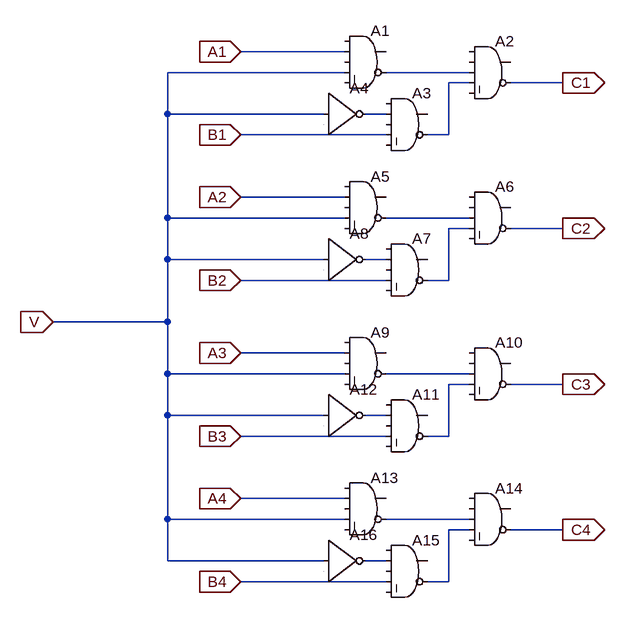
[diagram p0: schematic mul.asc]
mul.asc, the LTspice schematic file:
Version 4
SHEET 1 2100 968
WIRE 592 -176 432 -176
WIRE 592 -144 320 -144
WIRE 784 -144 656 -144
WIRE 784 -128 752 -128
WIRE 928 -128 848 -128
WIRE 320 -80 320 -144
WIRE 560 -80 320 -80
WIRE 656 -80 624 -80
WIRE 656 -48 432 -48
WIRE 752 -48 752 -128
WIRE 752 -48 720 -48
WIRE 592 48 432 48
WIRE 320 80 320 -80
WIRE 592 80 320 80
WIRE 784 80 656 80
WIRE 784 96 752 96
WIRE 928 96 848 96
WIRE 320 144 320 80
WIRE 560 144 320 144
WIRE 656 144 624 144
WIRE 656 176 432 176
WIRE 752 176 752 96
WIRE 752 176 720 176
WIRE 320 240 320 144
WIRE 320 240 144 240
WIRE 592 288 432 288
WIRE 320 320 320 240
WIRE 592 320 320 320
WIRE 784 320 656 320
WIRE 784 336 752 336
WIRE 928 336 848 336
WIRE 320 384 320 320
WIRE 560 384 320 384
WIRE 656 384 624 384
WIRE 656 416 432 416
WIRE 752 416 752 336
WIRE 752 416 720 416
WIRE 592 512 432 512
WIRE 320 544 320 384
WIRE 592 544 320 544
WIRE 784 544 656 544
WIRE 784 560 752 560
WIRE 928 560 848 560
WIRE 320 608 320 544
WIRE 560 608 320 608
WIRE 656 608 624 608
WIRE 656 640 432 640
WIRE 752 640 752 560
WIRE 752 640 720 640
FLAG 432 -176 A1
IOPIN 432 -176 In
FLAG 432 -48 B1
IOPIN 432 -48 In
FLAG 144 240 V
IOPIN 144 240 In
FLAG 432 48 A2
IOPIN 432 48 In
FLAG 432 176 B2
IOPIN 432 176 In
FLAG 432 288 A3
IOPIN 432 288 In
FLAG 432 416 B3
IOPIN 432 416 In
FLAG 432 512 A4
IOPIN 432 512 In
FLAG 432 640 B4
IOPIN 432 640 In
FLAG 928 -128 C1
IOPIN 928 -128 Out
FLAG 928 96 C2
IOPIN 928 96 Out
FLAG 928 336 C3
IOPIN 928 336 Out
FLAG 928 560 C4
IOPIN 928 560 Out
SYMBOL Digital\\and 624 -224 R0
SYMATTR InstName A1
SYMBOL Digital\\and 816 -208 R0
SYMATTR InstName A2
SYMBOL Digital\\and 688 -128 R0
SYMATTR InstName A3
SYMBOL Digital\\inv 560 -144 R0
SYMATTR InstName A4
SYMBOL Digital\\and 624 0 R0
SYMATTR InstName A5
SYMBOL Digital\\and 816 16 R0
SYMATTR InstName A6
SYMBOL Digital\\and 688 96 R0
SYMATTR InstName A7
SYMBOL Digital\\inv 560 80 R0
SYMATTR InstName A8
SYMBOL Digital\\and 624 240 R0
SYMATTR InstName A9
SYMBOL Digital\\and 816 256 R0
SYMATTR InstName A10
SYMBOL Digital\\and 688 336 R0
SYMATTR InstName A11
SYMBOL Digital\\inv 560 320 R0
SYMATTR InstName A12
SYMBOL Digital\\and 624 464 R0
SYMATTR InstName A13
SYMBOL Digital\\and 816 480 R0
SYMATTR InstName A14
SYMBOL Digital\\and 688 560 R0
SYMATTR InstName A15
SYMBOL Digital\\inv 560 544 R0
SYMATTR InstName A16

The netlist it stands for:
* mul.asc
A1 0 A1 0 V 0 N001 0 0 AND
A2 0 0 N001 N002 0 C1 0 0 AND
A3 0 N003 0 B1 0 N002 0 0 AND
A4 V 0 0 0 0 N003 0 0 BUF
A5 0 A2 0 V 0 N004 0 0 AND
A6 0 0 N004 N005 0 C2 0 0 AND
A7 0 N006 0 B2 0 N005 0 0 AND
A8 V 0 0 0 0 N006 0 0 BUF
A9 0 A3 0 V 0 N007 0 0 AND
A10 0 0 N007 N008 0 C3 0 0 AND
A11 0 N009 0 B3 0 N008 0 0 AND
A12 V 0 0 0 0 N009 0 0 BUF
A13 0 A4 0 V 0 N010 0 0 AND
A14 0 0 N010 N011 0 C4 0 0 AND
A15 0 N012 0 B4 0 N011 0 0 AND
A16 V 0 0 0 0 N012 0 0 BUF
.backanno
.end